# EasyEDA schematic SCH_AIME_CARD_READER.json
TITLE: Sheet_1; REV: 1.0; Date: 2024-01-05; Sheet: 1/1; Drawn By: Qinh; Company: Your Company
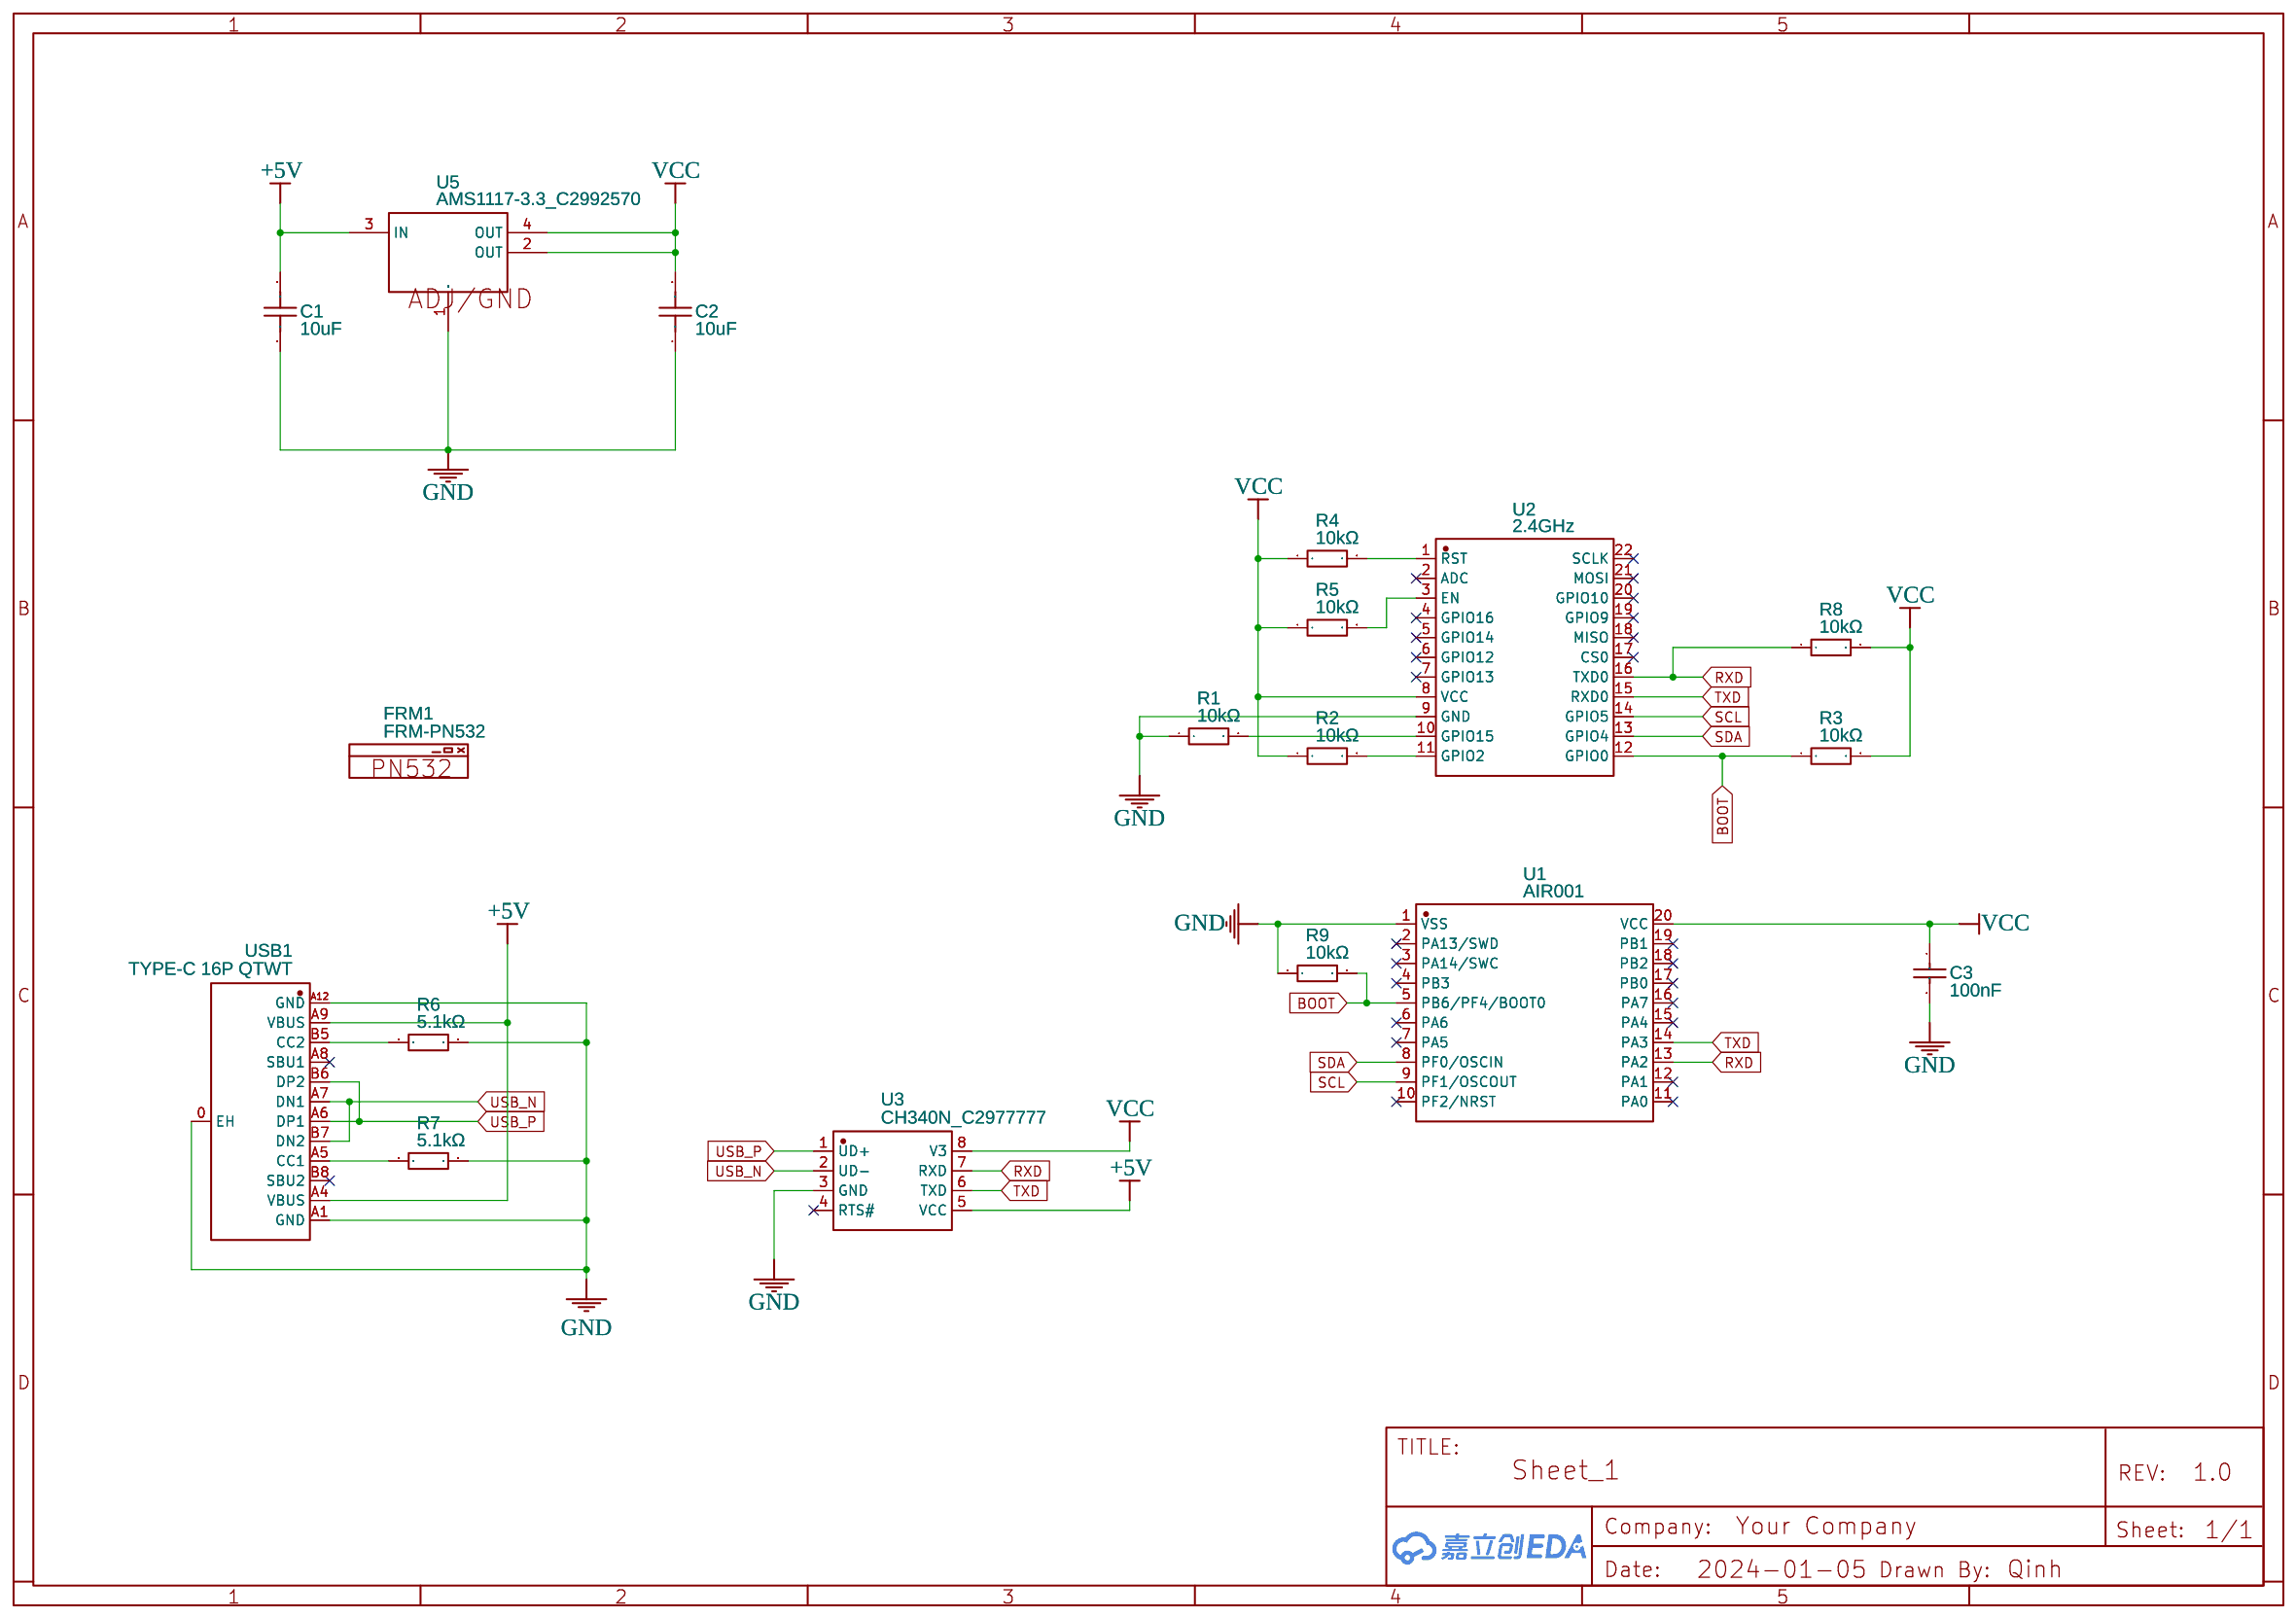
[diagram p0: schematic sheet]

## Parts
C1  10uF  [C0603]
C2  10uF  [C0603]
C3  100nF  [C0603]
FRM1  FRM-PN532  [FRM-PN532]
R1  10kΩ  [R0603]
R2  10kΩ  [R0603]
R3  10kΩ  [R0603]
R4  10kΩ  [R0603]
R5  10kΩ  [R0603]
R6  5.1kΩ  [R0603]
R7  5.1kΩ  [R0603]
R8  10kΩ  [R0603]
R9  10kΩ  [R0603]
U1  AIR001  [TSSOP-20_L6.5-W4.4-P0.65-LS6.4-BL]
U2  2.4GHz  [WIFIM-SMD_ESP-12F-ESP8266MOD]
U3  CH340N_C2977777  [SOP-8_L4.9-W3.9-P1.27-LS6.0-BL]
U5  AMS1117-3.3_C2992570  [SOT-223-3_L6.4-W3.5-P2.30-LS7.0-BR]
USB1  TYPE-C 16P QTWT  [USB-TYPE-C-SMD_TYPE-C-16P-QTWT]

## Library data of the parts
C1 C2 = CL10A106KP8NNNC: Supplier: LCSC; Manufacturer: SAMSUNG(三星); Supplier Part: C19702; JLCPCB Part Class: Basic Part
C3 = 0603B104K500NT: Supplier: LCSC; Manufacturer: FH(风华); Supplier Part: C30926; JLCPCB Part Class: Extended Part
FRM1 = FRM-PN532: Contributor: yihai
R1-R5 R8 R9 = 0603WAF1002T5E: Supplier: LCSC; Manufacturer: UNI-ROYAL(厚声); Supplier Part: C25804; JLCPCB Part Class: Basic Part
R6 R7 = RMC06035.1K1%N: Supplier: LCSC; Supplier Part: C269716; Manufacturer: Tyohm(幸亚电阻); Resistance (Ohms): 5.1K; Contributor: LCSC; JLCPCB Part Class: Extended Part
U1 = AIR001: Contributor: lcsc; Supplier: LCSC; Supplier Part: C7461672; Manufacturer: Luat(合宙)
U2 = ESP-12F(ESP8266MOD): Supplier: LCSC; Manufacturer: Ai-Thinker(安信可); Supplier Part: C82891; JLCPCB Part Class: Extended Part
U3 = CH340N_C2977777: Supplier: LCSC; Supplier Part: C2977777; Manufacturer: WCH(南京沁恒); Manufacturer Part: CH340N; Contributor: LCSC; JLCPCB Part Class: Extended Part
U5 = AMS1117-3.3_C2992570: Supplier: LCSC; Supplier Part: C2992570; Manufacturer: 国芯佳品; Manufacturer Part: AMS1117-3.3; link: https://atta.szlcsc.comnull; Contributor: lcsc; JLCPCB Part Class: Extended Part
USB1 = TYPE-C 16P QTWT: Contributor: lcsc; Supplier: LCSC; Supplier Part: C5187472; Manufacturer: SHOU HAN(首韩); JLCPCB Part Class: Extended Part

## Nets
+5V: C1.2 U3.5(VCC) U5.3(IN) USB1.A4(VBUS) USB1.A9(VBUS)
GND: C1.1 C2.1 C3.2 R1.1 R6.1 R7.1 R9.1 U1.1(VSS) U2.9(GND) U3.3(GND) U5.1(ADJ/GND) USB1.0(EH) USB1.A1(GND) USB1.A12(GND)
VCC: C2.2 C3.1 R2.1 R3.2 R4.1 R5.1 R8.2 U1.20(VCC) U2.8(VCC) U3.8(V3) U5.2(OUT) U5.4(OUT)
BOOT: R3.1 R9.2 U1.5(PB6/PF4/BOOT0) U2.12(GPIO0)
RXD: R8.1 U1.13(PA2) U2.16(TXD0) U3.7(RXD)
SCL: U1.9(PF1/OSCOUT) U2.14(GPIO5)
SDA: U1.8(PF0/OSCIN) U2.13(GPIO4)
TXD: U1.14(PA3) U2.15(RXD0) U3.6(TXD)
USB_N: U3.2(UD-) USB1.A7(DN1) USB1.B7(DN2)
USB_P: U3.1(UD+) USB1.A6(DP1) USB1.B6(DP2)
Net-(R1-2): R1.2 U2.10(GPIO15)
Net-(R2-2): R2.2 U2.11(GPIO2)
Net-(R4-2): R4.2 U2.1(RST)
Net-(R5-2): R5.2 U2.3(EN)
Net-(R6-2): R6.2 USB1.B5(CC2)
Net-(R7-2): R7.2 USB1.A5(CC1)

Not connected (* = marked no-connect by the designer): U1 2(PA13/SWD)* 3(PA14/SWC)* 4(PB3)* 6(PA6)* 7(PA5)* 10(PF2/NRST)* 11(PA0)* 12(PA1)* 15(PA4)* 16(PA7)* 17(PB0)* 18(PB2)* 19(PB1)*; U2 2(ADC)* 4(GPIO16)* 5(GPIO14)* 6(GPIO12)* 7(GPIO13)* 17(CS0)* 18(MISO)* 19(GPIO9)* 20(GPIO10)* 21(MOSI)* 22(SCLK)*; U3 4(RTS#)*; USB1 A8(SBU1)* B8(SBU2)*
